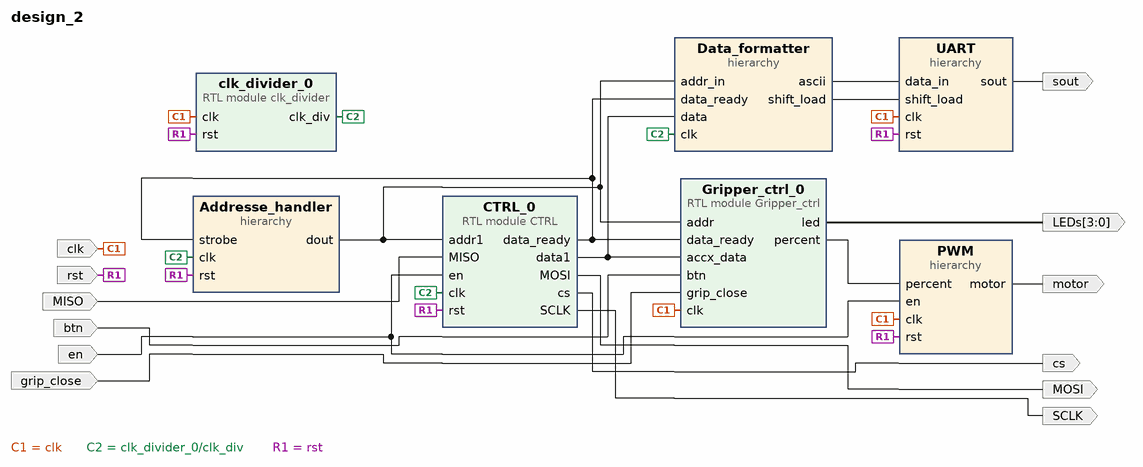
[diagram p0: block diagram of the top level]
# Vivado block design design_2, xc7z020clg400-1, Vivado 2021.1
create_bd_design design_2

create_bd_port -dir I -type clk clk
create_bd_port -dir I -type rst rst
create_bd_port -dir I en
create_bd_port -dir O cs
create_bd_port -dir O MOSI
create_bd_port -dir O SCLK
create_bd_port -dir I MISO
create_bd_port -dir O sout
create_bd_port -dir O -from 3 -to 0 LEDs
create_bd_port -dir I btn
create_bd_port -dir I grip_close
create_bd_port -dir O motor

create_bd_cell -type module -reference clk_divider clk_divider_0
create_bd_cell -type module -reference CTRL CTRL_0
create_bd_cell -type module -reference Gripper_ctrl Gripper_ctrl_0
create_bd_cell -type hier Addresse_handler
create_bd_cell -type hier Data_formatter
create_bd_cell -type hier PWM
create_bd_cell -type hier UART

# ---- hierarchy /Addresse_handler ----
current_bd_instance /Addresse_handler
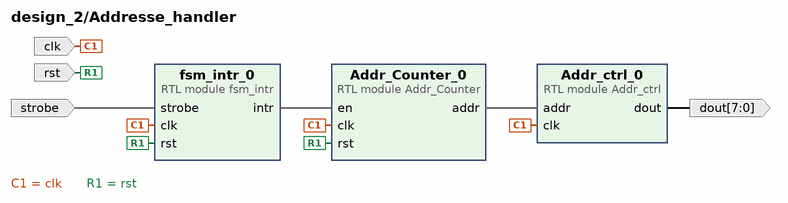
[diagram p1: block diagram inside /Addresse_handler]
create_bd_pin -dir I -type clk clk
create_bd_pin -dir I -type rst rst
create_bd_pin -dir I strobe
create_bd_pin -dir O -from 7 -to 0 dout

create_bd_cell -type module -reference fsm_intr fsm_intr_0
create_bd_cell -type module -reference Addr_Counter Addr_Counter_0
create_bd_cell -type module -reference Addr_ctrl Addr_ctrl_0

# ---- hierarchy /Data_formatter ----
current_bd_instance /Data_formatter
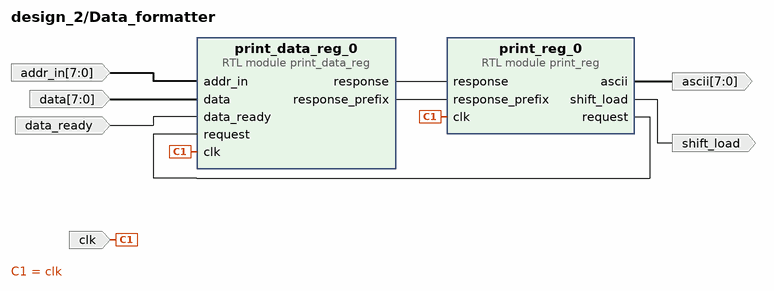
[diagram p2: block diagram inside /Data_formatter]
create_bd_pin -dir I -type clk clk
create_bd_pin -dir I data_ready
create_bd_pin -dir I -from 7 -to 0 addr_in
create_bd_pin -dir I -from 7 -to 0 data
create_bd_pin -dir O shift_load
create_bd_pin -dir O -from 7 -to 0 ascii

create_bd_cell -type module -reference print_data_reg print_data_reg_0
create_bd_cell -type module -reference print_reg print_reg_0

# ---- hierarchy /PWM ----
current_bd_instance /PWM
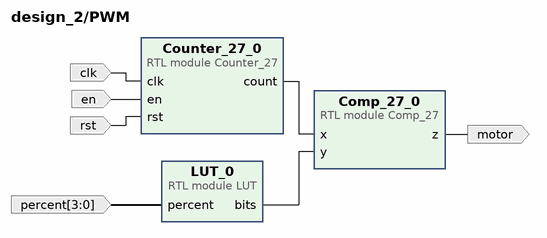
[diagram p3: block diagram inside /PWM]
create_bd_pin -dir I en
create_bd_pin -dir I -type clk clk
create_bd_pin -dir I -type rst rst
create_bd_pin -dir I -from 3 -to 0 percent
create_bd_pin -dir O motor

create_bd_cell -type module -reference Counter_27 Counter_27_0
create_bd_cell -type module -reference LUT LUT_0
create_bd_cell -type module -reference Comp_27 Comp_27_0

# ---- hierarchy /UART ----
current_bd_instance /UART
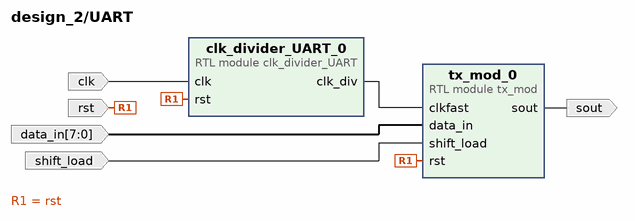
[diagram p4: block diagram inside /UART]
create_bd_pin -dir I -type clk clk
create_bd_pin -dir I -type rst rst
create_bd_pin -dir I -from 7 -to 0 data_in
create_bd_pin -dir I shift_load
create_bd_pin -dir O sout

create_bd_cell -type module -reference clk_divider_UART clk_divider_UART_0
create_bd_cell -type module -reference tx_mod tx_mod_0

# ---- connections ----

current_bd_instance /Addresse_handler
connect_bd_net [get_bd_pins Addr_Counter_0/addr] [get_bd_pins Addr_ctrl_0/addr]
connect_bd_net [get_bd_pins Addr_ctrl_0/dout] [get_bd_pins dout]
connect_bd_net -net CTRL_0_data_ready [get_bd_pins strobe] [get_bd_pins fsm_intr_0/strobe]
connect_bd_net -net clk_divider_0_clk_div [get_bd_pins clk] \
  [get_bd_pins Addr_Counter_0/clk] [get_bd_pins Addr_ctrl_0/clk] [get_bd_pins fsm_intr_0/clk]
connect_bd_net [get_bd_pins fsm_intr_0/intr] [get_bd_pins Addr_Counter_0/en]
connect_bd_net -net rst_0_1 [get_bd_pins rst] [get_bd_pins Addr_Counter_0/rst] [get_bd_pins fsm_intr_0/rst]

current_bd_instance /Data_formatter
connect_bd_net -net Addr_ctrl_0_dout [get_bd_pins addr_in] [get_bd_pins print_data_reg_0/addr_in]
connect_bd_net -net CTRL_0_data1 [get_bd_pins data] [get_bd_pins print_data_reg_0/data]
connect_bd_net -net CTRL_0_data_ready [get_bd_pins data_ready] [get_bd_pins print_data_reg_0/data_ready]
connect_bd_net -net clk_divider_0_clk_div [get_bd_pins clk] [get_bd_pins print_reg_0/clk] [get_bd_pins print_data_reg_0/clk]
connect_bd_net [get_bd_pins print_data_reg_0/response] [get_bd_pins print_reg_0/response]
connect_bd_net [get_bd_pins print_data_reg_0/response_prefix] [get_bd_pins print_reg_0/response_prefix]
connect_bd_net [get_bd_pins print_reg_0/ascii] [get_bd_pins ascii]
connect_bd_net [get_bd_pins print_reg_0/request] [get_bd_pins print_data_reg_0/request]
connect_bd_net [get_bd_pins print_reg_0/shift_load] [get_bd_pins shift_load]

current_bd_instance /PWM
connect_bd_net [get_bd_pins Comp_27_0/z] [get_bd_pins motor]
connect_bd_net [get_bd_pins Counter_27_0/count] [get_bd_pins Comp_27_0/x]
connect_bd_net -net Gripper_ctrl_0_percent [get_bd_pins percent] [get_bd_pins LUT_0/percent]
connect_bd_net [get_bd_pins LUT_0/bits] [get_bd_pins Comp_27_0/y]
connect_bd_net -net clk_0_1 [get_bd_pins clk] [get_bd_pins Counter_27_0/clk]
connect_bd_net -net en_0_1 [get_bd_pins en] [get_bd_pins Counter_27_0/en]
connect_bd_net -net rst_0_1 [get_bd_pins rst] [get_bd_pins Counter_27_0/rst]

current_bd_instance /UART
connect_bd_net -net clk_0_1 [get_bd_pins clk] [get_bd_pins clk_divider_UART_0/clk]
connect_bd_net [get_bd_pins clk_divider_UART_0/clk_div] [get_bd_pins tx_mod_0/clkfast]
connect_bd_net -net print_reg_0_ascii [get_bd_pins data_in] [get_bd_pins tx_mod_0/data_in]
connect_bd_net -net print_reg_0_shift_load [get_bd_pins shift_load] [get_bd_pins tx_mod_0/shift_load]
connect_bd_net -net rst_0_1 [get_bd_pins rst] [get_bd_pins tx_mod_0/rst] [get_bd_pins clk_divider_UART_0/rst]
connect_bd_net [get_bd_pins tx_mod_0/sout] [get_bd_pins sout]

current_bd_instance /
connect_bd_net -net Addr_ctrl_0_dout [get_bd_pins Addresse_handler/dout] \
  [get_bd_pins CTRL_0/addr1] [get_bd_pins Gripper_ctrl_0/addr] [get_bd_pins Data_formatter/addr_in]
connect_bd_net [get_bd_pins CTRL_0/MOSI] [get_bd_ports MOSI]
connect_bd_net [get_bd_pins CTRL_0/SCLK] [get_bd_ports SCLK]
connect_bd_net [get_bd_pins CTRL_0/cs] [get_bd_ports cs]
connect_bd_net [get_bd_pins CTRL_0/data1] [get_bd_pins Gripper_ctrl_0/accx_data] [get_bd_pins Data_formatter/data]
connect_bd_net [get_bd_pins CTRL_0/data_ready] \
  [get_bd_pins Gripper_ctrl_0/data_ready] [get_bd_pins Addresse_handler/strobe] [get_bd_pins Data_formatter/data_ready]
connect_bd_net -net Comp_27_0_z [get_bd_pins PWM/motor] [get_bd_ports motor]
connect_bd_net [get_bd_pins Gripper_ctrl_0/led] [get_bd_ports LEDs]
connect_bd_net [get_bd_pins Gripper_ctrl_0/percent] [get_bd_pins PWM/percent]
connect_bd_net -net MISO_0_1 [get_bd_ports MISO] [get_bd_pins CTRL_0/MISO]
connect_bd_net -net btn_0_1 [get_bd_ports btn] [get_bd_pins Gripper_ctrl_0/btn]
connect_bd_net -net clk_0_1 [get_bd_ports clk] \
  [get_bd_pins clk_divider_0/clk] [get_bd_pins Gripper_ctrl_0/clk] [get_bd_pins PWM/clk] [get_bd_pins UART/clk]
connect_bd_net [get_bd_pins clk_divider_0/clk_div] [get_bd_pins CTRL_0/clk] [get_bd_pins Addresse_handler/clk] [get_bd_pins Data_formatter/clk]
connect_bd_net -net en_0_1 [get_bd_ports en] [get_bd_pins CTRL_0/en] [get_bd_pins PWM/en]
connect_bd_net -net grip_close_0_1 [get_bd_ports grip_close] [get_bd_pins Gripper_ctrl_0/grip_close]
connect_bd_net -net print_reg_0_ascii [get_bd_pins Data_formatter/ascii] [get_bd_pins UART/data_in]
connect_bd_net -net print_reg_0_shift_load [get_bd_pins Data_formatter/shift_load] [get_bd_pins UART/shift_load]
connect_bd_net -net rst_0_1 [get_bd_ports rst] \
  [get_bd_pins clk_divider_0/rst] [get_bd_pins CTRL_0/rst] [get_bd_pins Addresse_handler/rst] [get_bd_pins PWM/rst] \
  [get_bd_pins UART/rst]
connect_bd_net -net tx_mod_0_sout [get_bd_pins UART/sout] [get_bd_ports sout]

validate_bd_design
save_bd_design
